# Altium schematic sheet SHEET4.SCHDOC
size A4
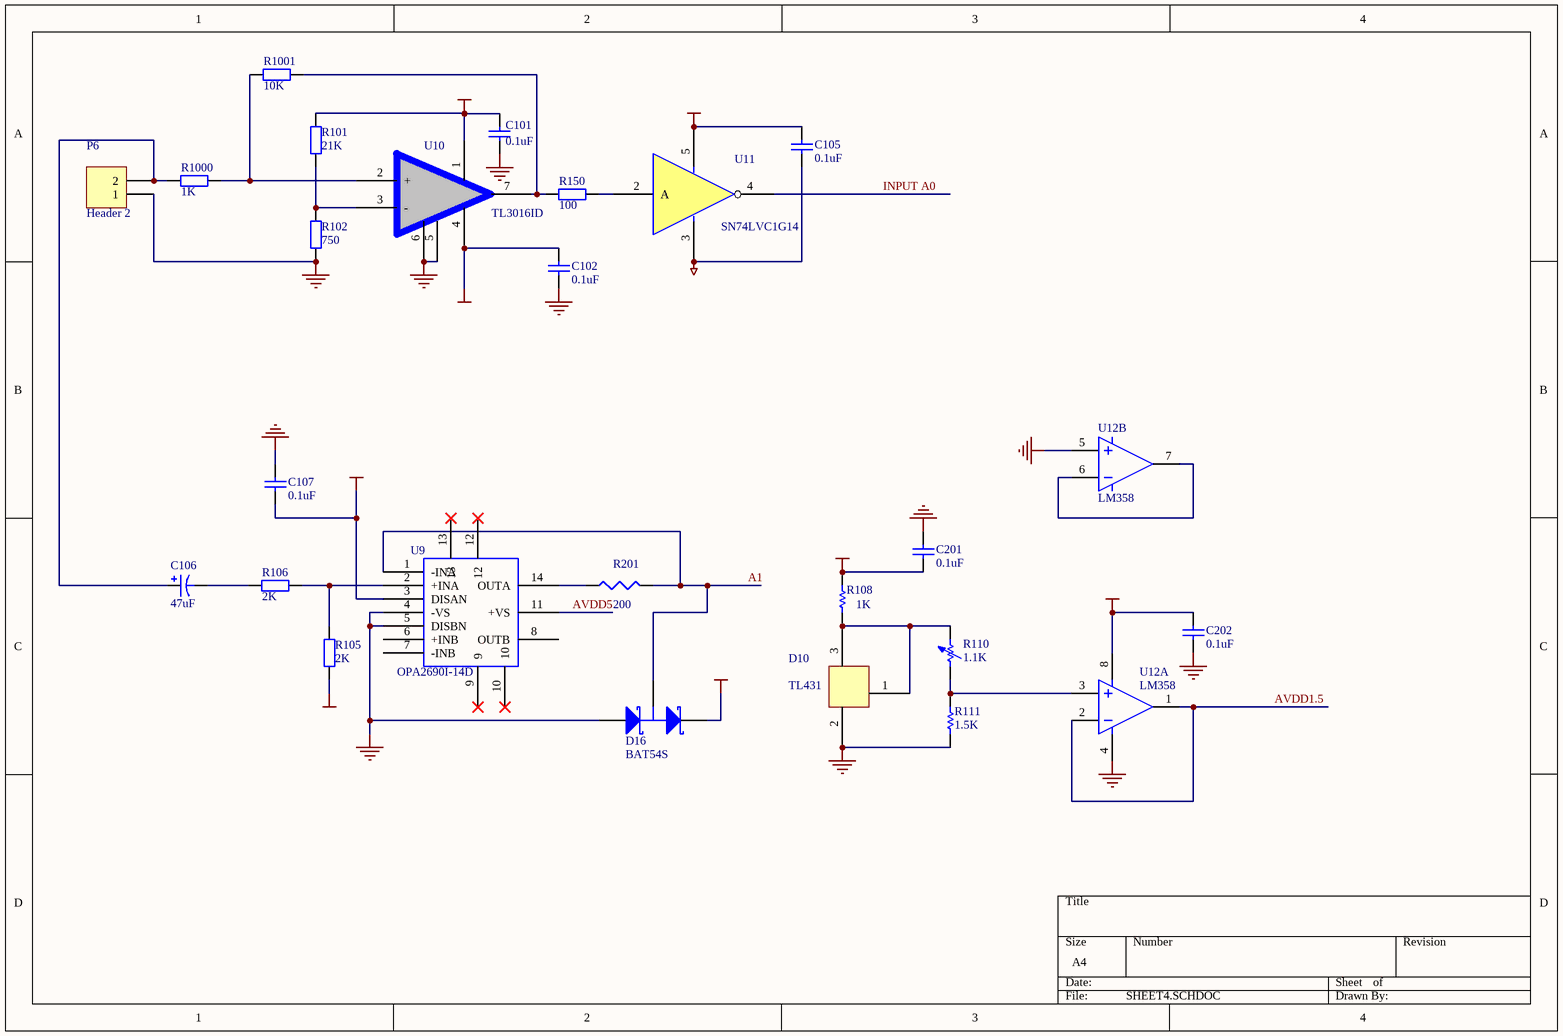
[diagram p0: SHEET4.SCHDOC]

## Parts
C101  0.1uF  [CC2012-0805]
C102  0.1uF  [CC2012-0805]
C105  0.1uF  [CC2012-0805]
C106  47uF  [CA2522-0612]
C107  0.1uF  [CC2012-0805]
C201  0.1uF  [CC2012-0805]
C202  0.1uF  [CC2012-0805]
D10  TL431  [BCY-W3]
D16  BAT54S  [SOT23]
P6  Header 2  [5.08_A]
R101  21K  [CR2012-0805]
R102  750  [CR2012-0805]
R105  2K  [CR2012-0805]
R106  2K  [CR2012-0805]
R108  1K  [CR2012-0805]
R110  1.1K  [CR2012-0805]
R111  1.5K  [CR2012-0805]
R150  100  [CR2012-0805]
R201  200  [CR2012-0805]
R1000  1K  [CR2012-0805]
R1001  10K  [CR2012-0805]
U9  OPA2690I-14D  [SOP14]
U10  TL3016ID  [SOP8]
U11  SN74LVC1G14  [SC-70]
U12  LM358  [SO-8]  (parts A,B of 2)

## Nets
3.3V: C105.2 U11.5(VCC)
ADIOA3.3: D16.2(K)
AGND: C101.2 C102.1 C107.2 C201.2 C202.1 D10.2 D16.1(A) P6.1 R102.1 R111.1 U9.4(-VS) U9.5(DISBN) U10.5 U10.6 U12.4 U12.5
AVDD1.5: R105.1 U12.1 U12.2
AVDD5: C101.1 C107.1 C201.1 C202.2 R101.2 R108.2 U9.3(DISAN) U9.11(+VS) U10.1 U12.8
AVDD5N: C102.2 U10.4
DGND: C105.1 U11.3(GND)
A1: D16.3(C) R201.2 U9.1(-INA)
INPUT A0: U11.4(Y)
NetC106_1: C106.1 P6.2 R1000.1
NetC106_2: C106.2 R106.1
NetD10_1: D10.1 D10.3 R108.1 R110.2
NetR101_1: R101.1 R102.2 U10.3(-)
NetR105_2: R105.2 R106.2 U9.2(+INA)
NetR110_1: R110.1 R111.2 U12.3
NetR150_1: R150.1 R1001.2 U10.7
NetR150_2: R150.2 U11.2(A)
NetR201_1: R201.1 U9.14(OUTA)
NetR1000_2: R1000.2 R1001.1 U10.2(+)
NetU12_6: U12.6 U12.7

Not connected (* = marked no-connect by the designer): U9 6(+INB) 7(-INB) 8(OUTB) 9* 10* 12* 13*; U11 1(NC)

## Library data of the parts
C101 C102 C105 C107 = Cap: Capacitor; Published: 8-Jun-2000; LatestRevisionDate: 17-Jul-2002; LatestRevisionNote: Re-released for DXP Platform.; Publisher: Altium Limited
C106 = Cap Pol3: Polarized Capacitor (Surface Mount); Published: 8-Jun-2000; LatestRevisionDate: 17-Jul-2002; LatestRevisionNote: Re-released for DXP Platform.; PackageReference: C0805; Publisher: Altium Limited
C201 C202 = Cap Semi: Capacitor (Semiconductor SIM Model); Published: 8-Jun-2000; LatestRevisionDate: 17-Jul-2002; LatestRevisionNote: Re-released for DXP Platform.; PackageReference: C1206; Publisher: Altium Limited
D16 = BAT54S: Schottky Barrier Double Diode; Published: 17-Sep-2003; DatasheetDocument: 4-Mar-2002; PackageDocument: May-1999; PackageReference: SOT23; Publisher: Altium Limited; ComponentLink1Description: Manufacturer Link; ComponentLink1URL: http://www.semiconductors.philips.com/
P6 = Header 2: Header, 2-Pin; LatestRevisionDate: 17-Jul-2002; LatestRevisionNote: Re-released for DXP Platform.; Publisher: Altium Limited
R101 R102 R105 R106 R150 R1000 R1001 = Res2: Resistor; Published: 8-Jun-2000; LatestRevisionDate: 17-Jul-2002; LatestRevisionNote: Re-released for DXP Platform.; Publisher: Altium Limited
R108 R111 = Res1: Resistor; Published: 8-Jun-2000; LatestRevisionDate: 17-Jul-2002; LatestRevisionNote: Re-released for DXP Platform.; Publisher: Altium Limited
R110 = Res Adj1: Variable Resistor; Published: 8-Jun-2000; LatestRevisionDate: 17-Jul-2002; LatestRevisionNote: Re-released for DXP Platform.; Publisher: Altium Limited
R201 = Res3: Resistor; Published: 8-Jun-2000; LatestRevisionDate: 4-Mar-2005; LatestRevisionNote: PCB Footprint replaced.; Publisher: Altium Limited
U12 = LF353